# Altium schematic sheet L-Stick_sheet1_cover.SchDoc: L-Stick - Cover
size A4; DocumentNumber: 1; Revision: 1.0.0; SheetNumber: 1; SheetTotal: 5; DrawnBy: SU; DocumentSize: A4; PCAName: L-Stick
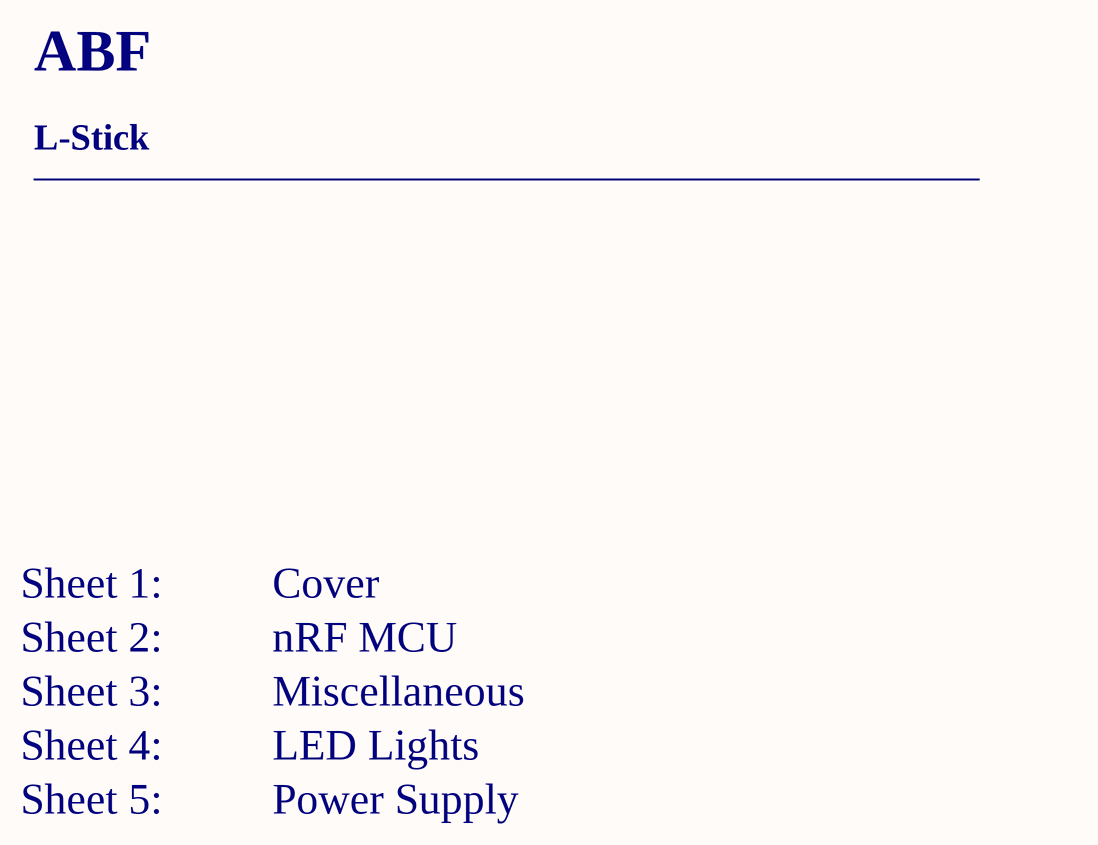
[diagram p0: L-Stick_sheet1_cover.SchDoc]

## Notes on the sheet
- ABF
- L-Stick
- ___________________________________________
- Sheet 1:          Cover
- Sheet 2:          nRF MCU
- Sheet 3:          Miscellaneous
- Sheet 4:          LED Lights
- Sheet 5:          Power Supply
- Title
- Size:
- Date:
- A4
- Number:
- Time:
- Revision:
- Sheet
- of
- File: